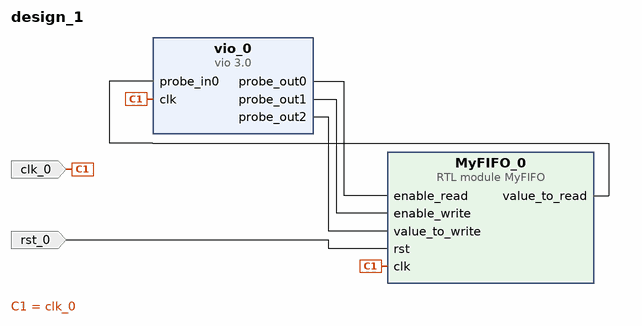
[diagram p0: block diagram of the top level]
# Vivado block design design_1, xc7a35ticsg324-1L, Vivado 2019.1
create_bd_design design_1

create_bd_port -dir I -type clk clk_0
create_bd_port -dir I -type rst rst_0

create_bd_cell -type module -reference MyFIFO MyFIFO_0
create_bd_cell -type ip -vlnv xilinx.com:ip:vio:3.0 vio_0
set_property -dict {CONFIG.C_NUM_PROBE_OUT 3 CONFIG.C_PROBE_OUT2_WIDTH 32} [get_bd_cells vio_0]

# ---- connections ----

connect_bd_net [get_bd_pins MyFIFO_0/value_to_read] [get_bd_pins vio_0/probe_in0]
connect_bd_net [get_bd_pins vio_0/probe_out0] [get_bd_pins MyFIFO_0/enable_read]
connect_bd_net [get_bd_pins vio_0/probe_out1] [get_bd_pins MyFIFO_0/enable_write]
connect_bd_net [get_bd_pins vio_0/probe_out2] [get_bd_pins MyFIFO_0/value_to_write]
connect_bd_net -net clk_0_1 [get_bd_ports clk_0] [get_bd_pins vio_0/clk] [get_bd_pins MyFIFO_0/clk]
connect_bd_net -net rst_0_1 [get_bd_ports rst_0] [get_bd_pins MyFIFO_0/rst]

validate_bd_design
save_bd_design
